# EAGLE design CFA_T_4L_B (EAGLE 9.4.2)
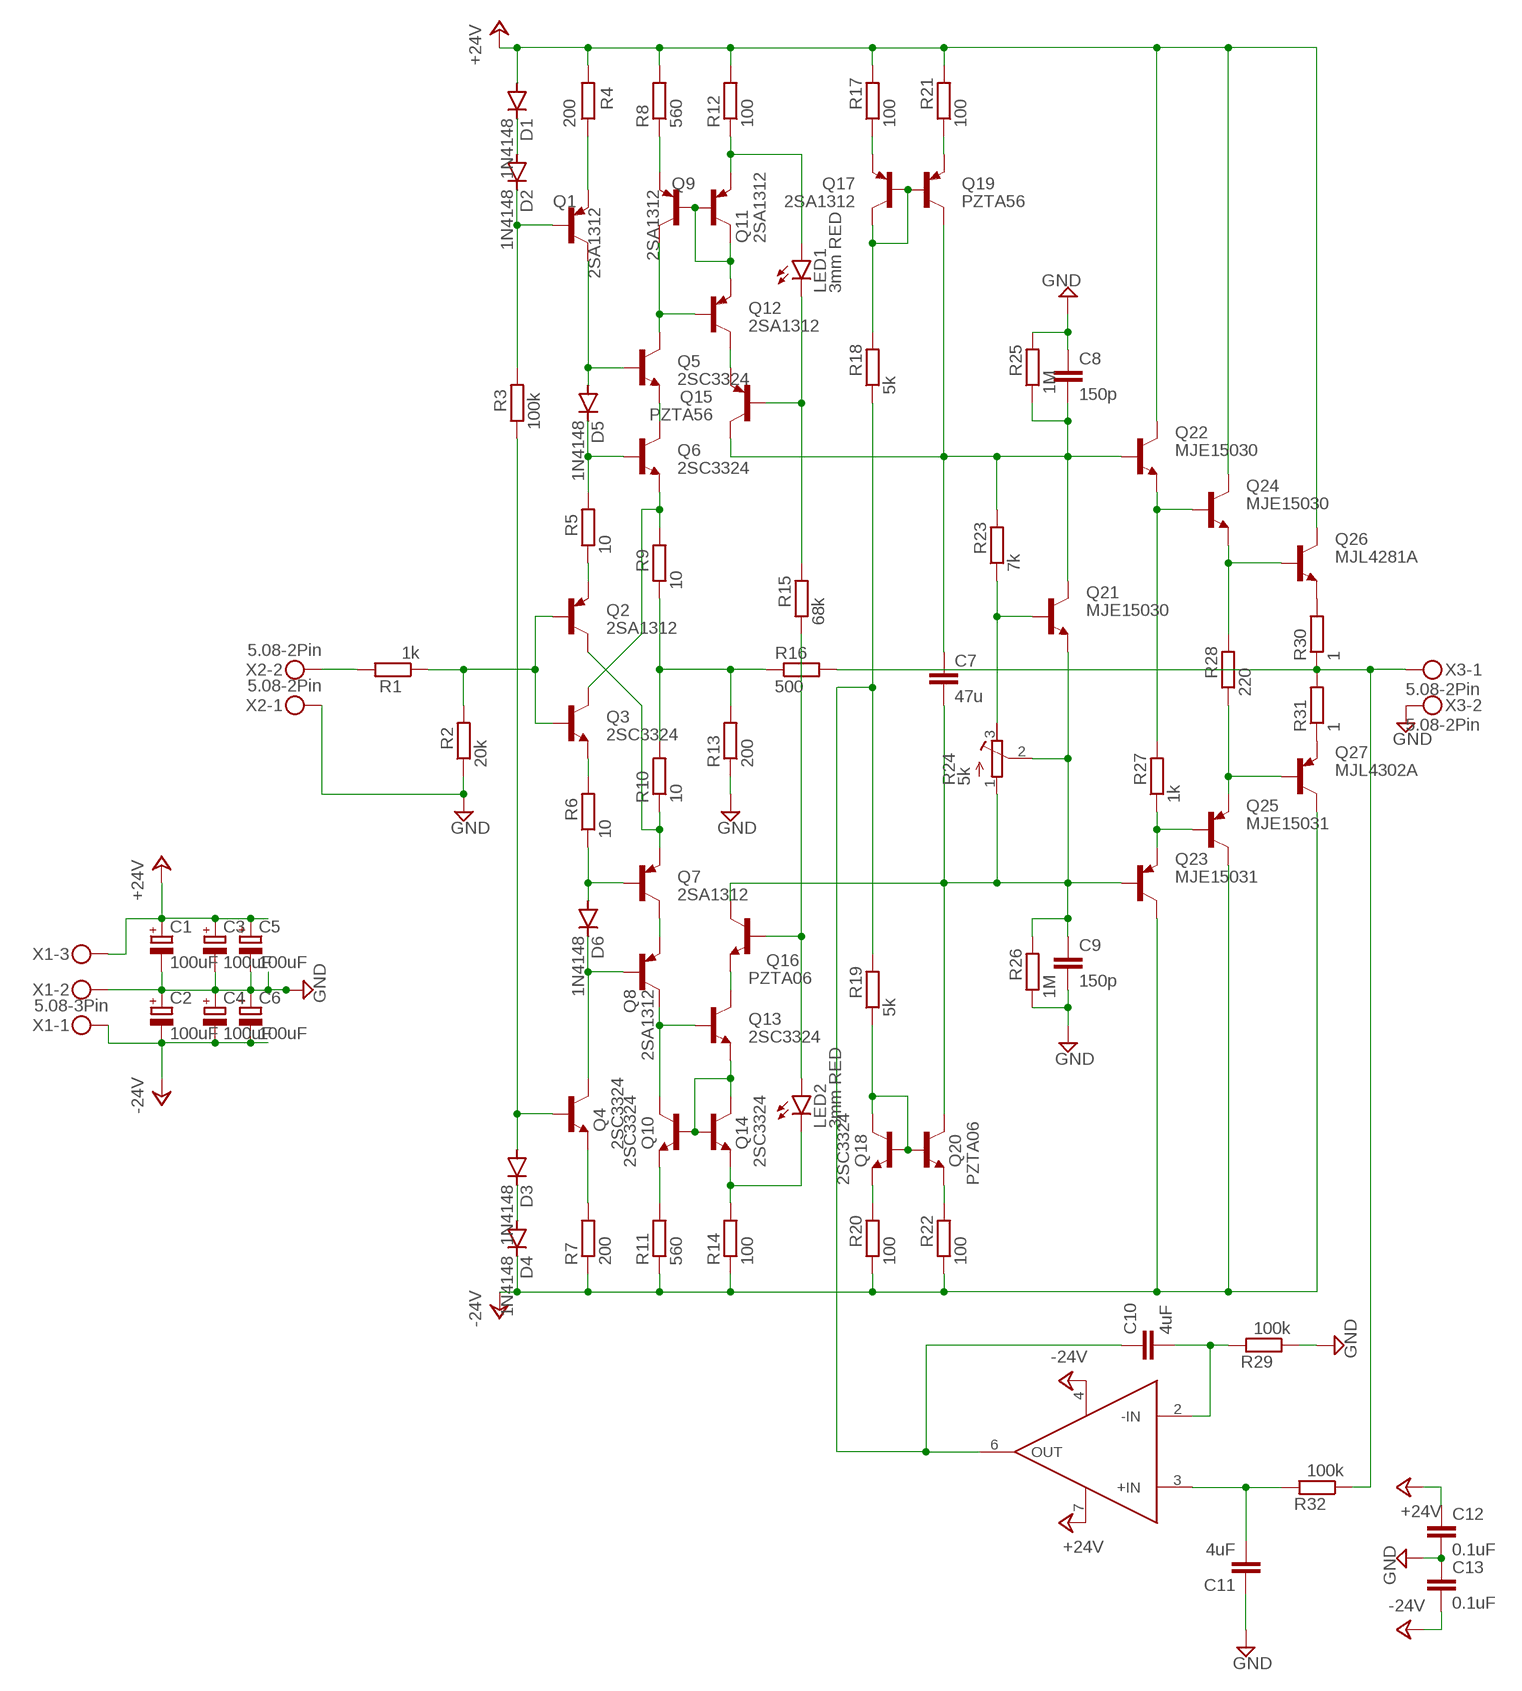
[diagram p0: schematic, sheet 1]

## Parts
C1  100uF  CPOL-EUE3.5-8  [E3,5-8]
C2  100uF  CPOL-EUE3.5-8  [E3,5-8]
C3  100uF  CPOL-EUE3.5-8  [E3,5-8]
C4  100uF  CPOL-EUE3.5-8  [E3,5-8]
C5  100uF  CPOL-EUE3.5-8  [E3,5-8]
C6  100uF  CPOL-EUE3.5-8  [E3,5-8]
C7  47u  C-EUC1210  [C1210]
C8  150p  C-EUC0805  [C0805]
C9  150p  C-EUC0805  [C0805]
C10  4uF  C-EUC1210  [C1210]
C11  4uF  C-EUC1210  [C1210]
C12  0.1uF  C-EUC0603K  [C0603K]
C13  0.1uF  C-EUC0603K  [C0603K]
D1  1N4148  DIODE-SOD80C  [SOD80C]
D2  1N4148  DIODE-SOD80C  [SOD80C]
D3  1N4148  DIODE-SOD80C  [SOD80C]
D4  1N4148  DIODE-SOD80C  [SOD80C]
D5  1N4148  DIODE-SOD80C  [SOD80C]
D6  1N4148  DIODE-SOD80C  [SOD80C]
LED1  3mm RED  LED3MM  [LED3MM]
LED2  3mm RED  LED3MM  [LED3MM]
Q1  2SA1312  TRANSISTOR_BC857C-PNP-SOT23-BEC  [TRANSISTOR_SOT23-BEC]
Q2  2SA1312  TRANSISTOR_BC857C-PNP-SOT23-BEC  [TRANSISTOR_SOT23-BEC]
Q3  2SC3324  TRANSISTOR_BC850-NPN-SOT23-BEC  [TRANSISTOR_SOT23-BEC]
Q4  2SC3324  TRANSISTOR_BC850-NPN-SOT23-BEC  [TRANSISTOR_SOT23-BEC]
Q5  2SC3324  TRANSISTOR_BC850-NPN-SOT23-BEC  [TRANSISTOR_SOT23-BEC]
Q6  2SC3324  TRANSISTOR_BC850-NPN-SOT23-BEC  [TRANSISTOR_SOT23-BEC]
Q7  2SA1312  TRANSISTOR_BC857C-PNP-SOT23-BEC  [TRANSISTOR_SOT23-BEC]
Q8  2SA1312  TRANSISTOR_BC857C-PNP-SOT23-BEC  [TRANSISTOR_SOT23-BEC]
Q9  2SA1312  TRANSISTOR_BC857C-PNP-SOT23-BEC  [TRANSISTOR_SOT23-BEC]
Q10  2SC3324  TRANSISTOR_BC850-NPN-SOT23-BEC  [TRANSISTOR_SOT23-BEC]
Q11  2SA1312  TRANSISTOR_BC857C-PNP-SOT23-BEC  [TRANSISTOR_SOT23-BEC]
Q12  2SA1312  TRANSISTOR_BC857C-PNP-SOT23-BEC  [TRANSISTOR_SOT23-BEC]
Q13  2SC3324  TRANSISTOR_BC847-NPN-SOT23-BEC  [TRANSISTOR_SOT23-BEC]
Q14  2SC3324  TRANSISTOR_BC850-NPN-SOT23-BEC  [TRANSISTOR_SOT23-BEC]
Q15  PZTA56  [SOT223]
Q16  PZTA06  PZTA06SOT-223  [SOT223]
Q17  2SA1312  TRANSISTOR_BC857C-PNP-SOT23-BEC  [TRANSISTOR_SOT23-BEC]
Q18  2SC3324  TRANSISTOR_BC850-NPN-SOT23-BEC  [TRANSISTOR_SOT23-BEC]
Q19  PZTA56  [SOT223]
Q20  PZTA06  PZTA06SOT-223  [SOT223]
Q21  MJE15030  TRANSISTOR_MJE15030  [TRANSISTOR_TO220KG]
Q22  MJE15030  TRANSISTOR_MJE15030  [TRANSISTOR_TO220KG]
Q23  MJE15031  TRANSISTOR_MJE15031  [TRANSISTOR_TO220KG]
Q24  MJE15030  TRANSISTOR_MJE15030  [TRANSISTOR_TO220KG]
Q25  MJE15031  TRANSISTOR_MJE15031  [TRANSISTOR_TO220KG]
Q26  MJL4281A  TO264_MJL4281  [TO264_TO-264]
Q27  MJL4302A  TO264_MJL4302  [TO264_TO-264]
R1  1k  R-EU_MELF0204W  [MINI_MELF-0204W]
R2  20k  R-EU_MELF0204W  [MINI_MELF-0204W]
R3  100k  R-EU_MELF0204W  [MINI_MELF-0204W]
R4  200  R-EU_MELF0204W  [MINI_MELF-0204W]
R5  10  R-EU_MELF0204W  [MINI_MELF-0204W]
R6  10  R-EU_MELF0204W  [MINI_MELF-0204W]
R7  200  R-EU_MELF0204W  [MINI_MELF-0204W]
R8  560  R-EU_MELF0204W  [MINI_MELF-0204W]
R9  10  R-EU_MELF0204W  [MINI_MELF-0204W]
R10  10  R-EU_MELF0204W  [MINI_MELF-0204W]
R11  560  R-EU_MELF0204W  [MINI_MELF-0204W]
R12  100  R-EU_MELF0204W  [MINI_MELF-0204W]
R13  200  R-EU_MELF0204W  [MINI_MELF-0204W]
R14  100  R-EU_MELF0204W  [MINI_MELF-0204W]
R15  68k  R-EU_MELF0204W  [MINI_MELF-0204W]
R16  500  R-EU_MELF0204W  [MINI_MELF-0204W]
R17  100  R-EU_MELF0204W  [MINI_MELF-0204W]
R18  5k  R-EU_MELF0204W  [MINI_MELF-0204W]
R19  5k  R-EU_MELF0204W  [MINI_MELF-0204W]
R20  100  R-EU_MELF0204W  [MINI_MELF-0204W]
R21  100  R-EU_MELF0204W  [MINI_MELF-0204W]
R22  100  R-EU_MELF0204W  [MINI_MELF-0204W]
R23  7k  R-EU_MELF0204W  [MINI_MELF-0204W]
R24  5k  R-TRIMM3296W  [RTRIM3296W]
R25  1M  R-EU_MELF0204W  [MINI_MELF-0204W]
R26  1M  R-EU_MELF0204W  [MINI_MELF-0204W]
R27  1k  R-EU_MELF0204W  [MINI_MELF-0204W]
R28  220  R-EU_MELF0204W  [MINI_MELF-0204W]
R29  100k  R-EU_MELF0204W  [MINI_MELF-0204W]
R30  1  R-EU_TO220  [TO220-2]
R31  1  R-EU_TO220  [TO220-2]
R32  100k  R-EU_MELF0204W  [MINI_MELF-0204W]
U1  OP27  OPA627BP  [DIL08]
X1  5.08-3Pin  CON-PHOENIX-508_MKDSN1,5/3-5,08  [CON-PHOENIX-508_MKDSN1,5/3-5,08]
X2  5.08-2Pin  CON-PHOENIX-508_MKDSN1,5/2-5,08  [CON-PHOENIX-508_MKDSN1,5/2-5,08]
X3  5.08-2Pin  CON-PHOENIX-508_MKDSN1,5/2-5,08  [CON-PHOENIX-508_MKDSN1,5/2-5,08]

## Nets
+24V: C1.+ C3.+ C5.+ C12.1 D1.A Q22.2(C) Q24.2(C) Q26.C R4.2 R8.2 R12.2 R17.2 R21.2 U1.7(V+) X1.3
-24V: C2.- C4.- C6.- C13.2 D4.C Q23.2(C) Q25.2(C) Q27.C R7.1 R11.1 R14.1 R20.1 R22.1 U1.4(V-) X1.1
GND: C1.- C2.+ C3.- C4.+ C5.- C6.+ C8.1 C9.2 C11.1 C12.2 C13.1 R2.1 R13.1 R25.2 R26.1 R29.1 X1.2 X2.1 X3.2
N$1: C7.2 C9.1 Q16.2(C) Q16.4(C) Q20.2(C) Q20.4(C) Q21.3(E) Q23.1(B) R24.1(A) R24.2(S) R26.2
N$2: Q21.1(B) R23.1 R24.3(E)
N$3: R1.2 X2.2
N$183: Q1.E R4.1
N$184: D5.A Q1.C Q5.B
N$185: D1.C D2.A
N$186: D2.C Q1.B R3.2
N$187: D5.C Q6.B R5.2
N$188: Q5.E Q6.C
N$189: Q3.C Q6.E R9.2
N$190: R9.1 R10.2 R13.2 R16.1
N$191: Q2.C Q7.E R10.1
N$192: D6.A Q7.B R6.1
N$193: D6.C Q4.C Q8.B
N$194: Q4.E R7.2
N$195: D3.C D4.A
N$196: Q7.C Q8.E
N$197: Q2.E R5.1
N$198: Q3.E R6.2
N$199: Q2.B Q3.B R1.1 R2.2
N$200: Q5.C Q9.C Q12.B
N$201: Q9.B Q11.B Q11.C Q12.E
N$202: Q9.E R8.1
N$203: LED1.A Q11.E R12.1
N$204: Q12.C Q15.3(E)
N$205: LED1.K(C) Q15.1(B) R15.2
N$206: Q10.B Q13.E Q14.B Q14.C
N$207: LED2.K(C) Q14.E R14.2
N$208: Q10.E R11.2
N$209: Q8.C Q10.C Q13.B
N$210: Q13.C Q16.3(E)
N$211: LED2.A Q16.1(B) R15.1
N$212: C7.1 C8.2 Q15.2(C) Q15.4(C) Q19.2(C) Q19.4(C) Q21.2(C) Q22.1(B) R23.2 R25.1
N$213: Q17.B Q17.C Q19.1(B) R18.2
N$214: Q18.B Q18.C Q20.1(B) R19.1
N$215: Q17.E R17.1
N$216: Q19.3(E) R21.1
N$218: R16.2 R30.1 R31.2 R32.1 X3.1
N$219: Q18.E R20.2
N$220: Q20.3(E) R22.2
N$221: Q22.3(E) Q24.1(B) R27.2
N$222: Q23.3(E) Q25.1(B) R27.1
N$224: Q24.3(E) Q26.B R28.2
N$225: Q25.3(E) Q27.B R28.1
N$226: Q26.E R30.2
N$227: Q27.E R31.1
N$228: C10.2 R29.2 U1.2(-IN)
N$229: C11.2 R32.2 U1.3(+IN)
N$230: D3.A Q4.B R3.1
N$232: C10.1 R18.1 R19.2 U1.6(OUT)

## Library data of the parts
C1-C6 = Vwvwbg:CPOL-EU: POLARIZED CAPACITOR, European symbol
C7-C11 = Vwvwbg:C-EU: CAPACITOR, European symbol; SPICEPREFIX: C
C12 C13 = Vwvwbg:C-EU: CAPACITOR, European symbol
D1-D6 = diode:DIODE-: DIODE; SPICEPREFIX: D
LED1 LED2 = Vwvwbg:LED: LED OSRAM: - CHIPLED LG R971, LG N971, LY N971, LG Q971, LY Q971, LO R971, LY R971 LH N974, LH R974 LS Q976, LO Q976, LY Q976 LO Q996 - Hyper CHIPLED LW Q18S LB Q993, LB Q99A, LB R99A - SideLED LS A670, LO A670, LY A670, LG A670, LP A670 LB A673, LV A673, LT A673, LW A673 LH A674 LY A675 LS A676, LA A676, LO A676, LY A676, LW A676 LS A679, LY A679, LG A679 - Hyper Micro SIDELED® LS Y876, LA Y876, LO Y876, LY Y876 LT Y87S - SmartLED LW L88C, LW L88S LB L89C, LB L89S, LG L890 LS L89K, LO L89K, LY L89K LS L896, LA L896, LO L896, LY L896 - TOPLED LS T670, LO T670, LY T670, LG T670, LP T670 LSG T670, LSP T670, LSY T670, LOP T670, LYG T670 LG T671, LOG T671, LSG T671 LB T673, LV T673, LT T673, LW T673 LH T674 LS T676, LA T676, LO T676, LY T676, LB T676, LH T676, LSB T676, LW T676 LB T67C, LV T67C, LT T67C, LS T67K, LO T67K, LY T67K, LW E67C LS E67B, LA E67B, LO E67B, LY E67B, LB E67C, LV E67C, LT E67C LW T67C LS T679, LY T679, LG T679 LS T770, LO T770, LY T770, LG T770, LP T770 LB T773, LV T773, LT T773, LW T773 LH T774 LS E675, LA E675, LY E675, LS T675 LS T776, LA T776, LO T776, LY T776, LB T776 LHGB T686 LT T68C, LB T68C - Hyper Mini TOPLED® LB M676 - Mini TOPLED Santana® LG M470 LS M47K, LO M47K, LY M47K Source: http://www.osram.convergy.de LUXEON: - LUMILED® LXK2-PW12-R00, LXK2-PW12-S00, LXK2-PW14-U00, LXK2-PW14-V00 LXK2-PM12-R00, LXK2-PM12-S00, LXK2-PM14-U00 LXK2-PE12-Q00, LXK2-PE12-R00, LXK2-PE12-S00, LXK2-PE14-T00, LXK2-PE14-U00 LXK2-PB12-K00, LXK2-PB12-L00, LXK2-PB12-M00, LXK2-PB14-N00, LXK2-PB14-P00, LXK2-PB14-Q00 LXK2-PR12-L00, LXK2-PR12-M00, LXK2-PR14-Q00, LXK2-PR14-R00 LXK2-PD12-Q00, LXK2-PD12-R00, LXK2-PD12-S00 LXK2-PH12-R00, LXK2-PH12-S00 LXK2-PL12-P00, LXK2-PL12-Q00, LXK2-PL12-R00 Source: www.luxeon.com KINGBRIGHT: KA-3528ASYC Source: www.kingbright.com; SPICEPREFIX: D
Q1 Q2 Q7-Q9 Q11 Q12 Q17 = Vwvwbg:TRANSISTOR_*-PNP-: PNP Transistror; SPICEPREFIX: Q
Q3-Q6 Q10 Q13 Q14 Q18 = Vwvwbg:TRANSISTOR_*-NPN-: NPN Transistror BF959 corrected 2008.03.06; SPICEPREFIX: Q
Q15 Q19 = Vwvwbg:PZTA56; SPICEPREFIX: Q
Q16 Q20 = Vwvwbg:PZTA06; SPICEPREFIX: Q
Q21 Q22 Q24 = Vwvwbg:TRANSISTOR_MJE15030; SPICEPREFIX: Q
Q23 Q25 = Vwvwbg:TRANSISTOR_MJE15031; SPICEPREFIX: Q
Q26 = Vwvwbg:TO264_MJL4281: MJL4281 NPN BCE TO-264; SPICEPREFIX: Q
Q27 = Vwvwbg:TO264_MJL4302: MJL4302 PNP BCE TO-264; SPICEPREFIX: Q
R1-R23 R25-R32 = Vwvwbg:R-EU_: RESISTOR, European symbol; SPICEPREFIX: R
R24 = rcl_mod:R-TRIMM: Trimm resistor; SPICEMODEL: X; SPICEPREFIX: Z; SPICEPREFIXL: POT
U1 = Vwvwbg:OPA627BP: OPERATIONAL AMPLIFIER
X1 = Vwvwbg:CON-PHOENIX-508_MKDSN1,5/3-5,08: MKDSN 1,5/ 3-5,08 Printklemme Nennstrom: 13,5 A Nennspannung: 250 V Rastermaß: 5,08 mm Polzahl: 3 Anschlussart: Schraubanschluss Montage: Löten Anschlussrichtung Leiter/Platine: 0 ° Artikelnummer: 1729131 Source: http://eshop.phoenixcontact.com .. 1729131.pdf
X2 X3 = Vwvwbg:CON-PHOENIX-508_MKDSN1,5/2-5,08: MKDSN 1,5/ 2-5,08 Printklemme Nennstrom: 13,5 A Nennspannung: 250 V Rastermaß: 5,08 mm Polzahl: 2 Anschlussart: Schraubanschluss Montage: Löten Anschlussrichtung Leiter/Platine: 0 ° Artikelnummer: 1729128 Source: http://eshop.phoenixcontact.com .. 1729128.pdf

## Board
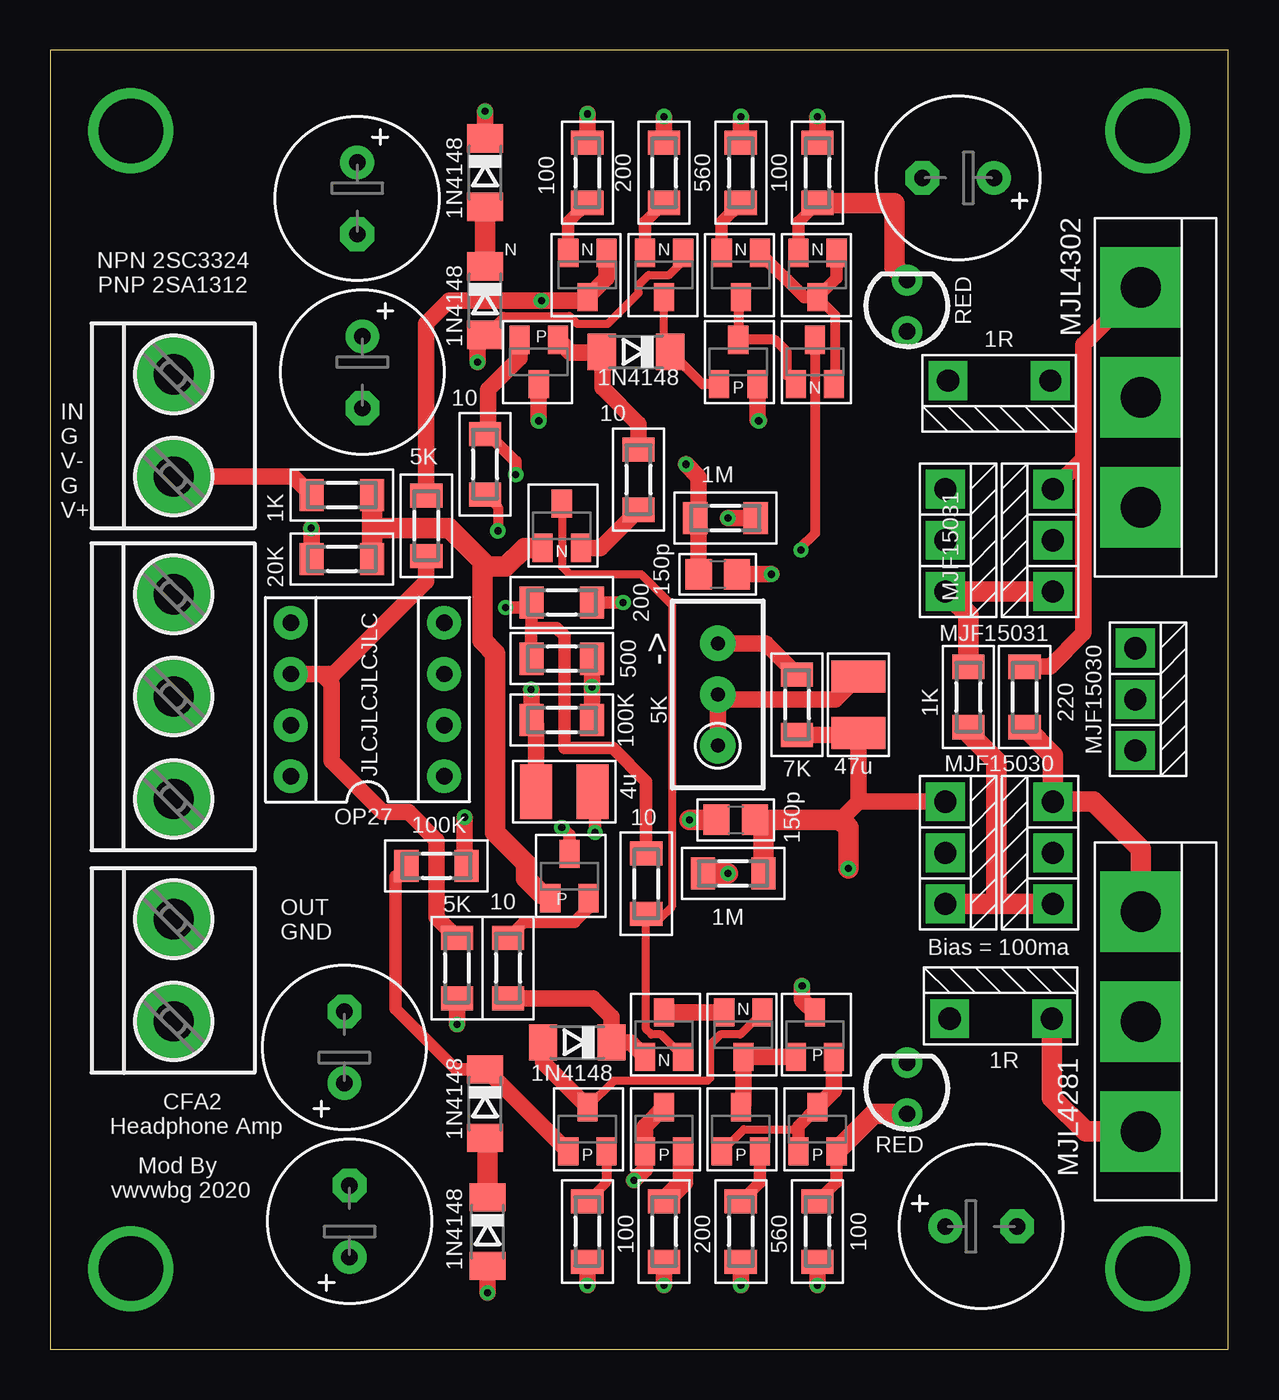
[diagram p1: board, top side]
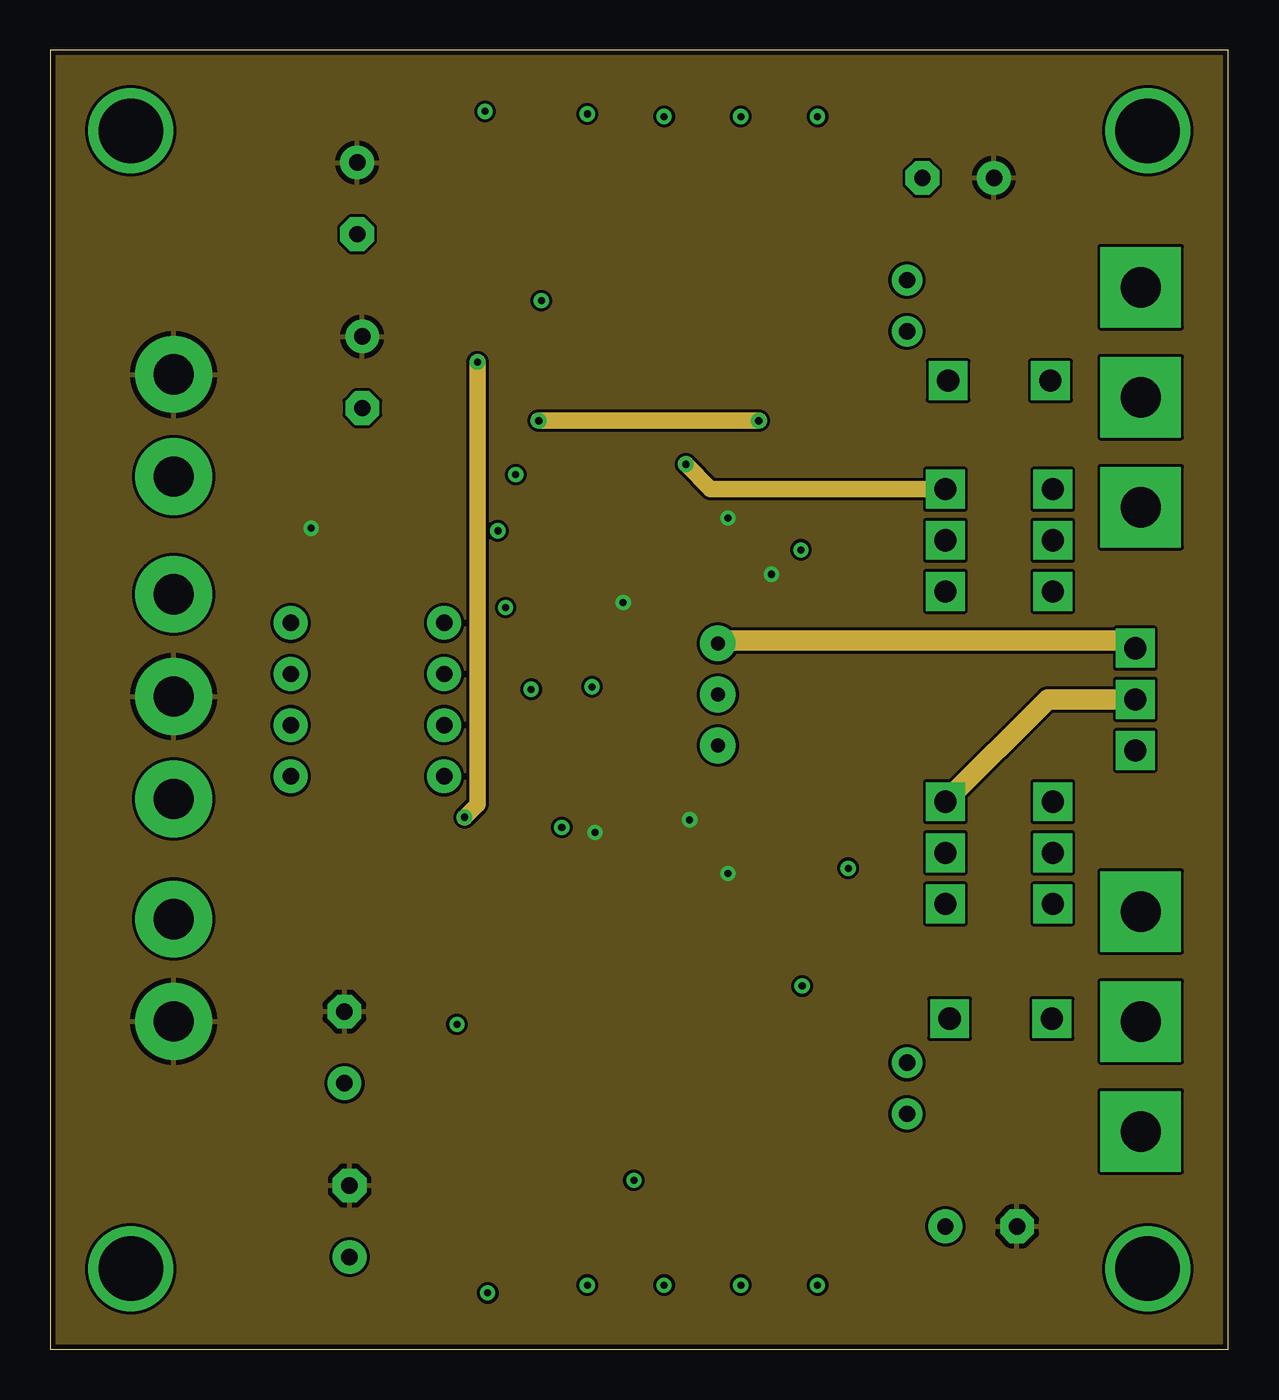
[diagram p2: board, inner layer Route2]
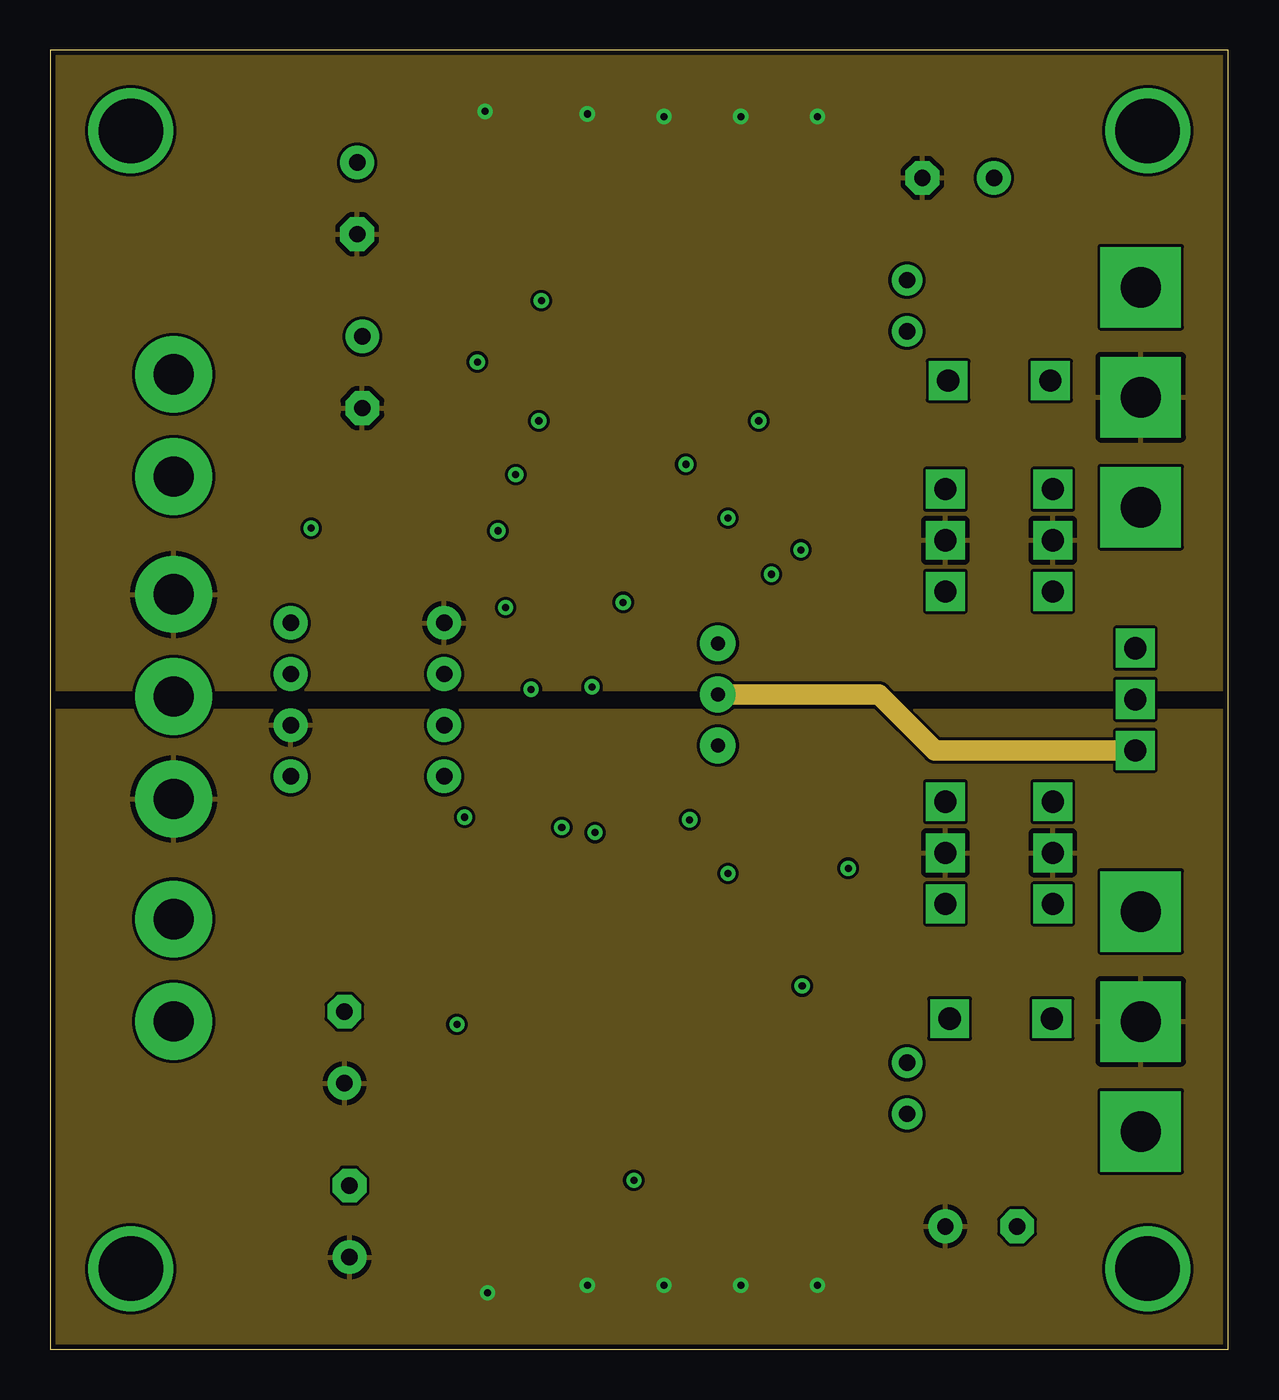
[diagram p3: board, inner layer Route15]
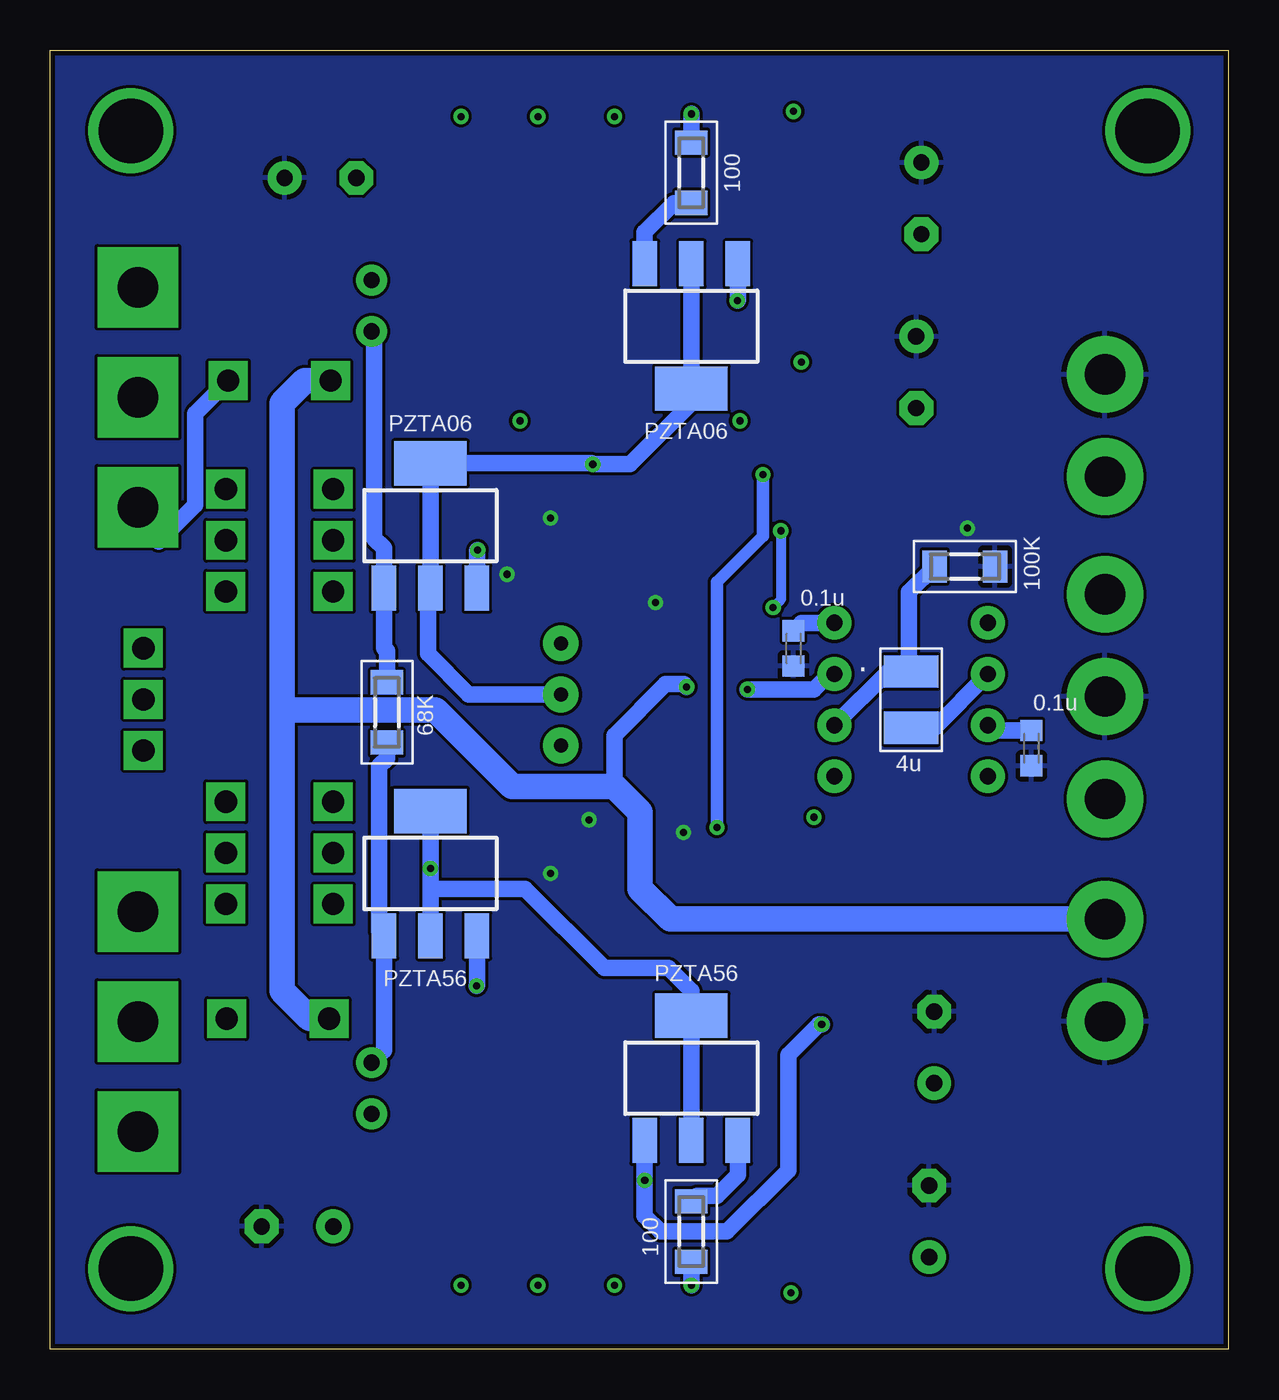
[diagram p4: board, bottom side, seen from below]

Size 58.5 x 64.5 mm. Coordinates in mm from the lower left corner, seen from the top.
Outline: 0,0 58.5,0 58.5,64.5 0,64.5 0,0
Copper layers (1+2*15+16): Top 0.035mm / dielectric 1.5mm / Route2 0.035mm / dielectric 0.15mm / Route15 0.035mm / dielectric 0.2mm / Bottom 0.035mm
Design rules "default *": minimum track width 6mil, minimum drill 0.35mm, track to track 6mil, track to pad 6mil, pad to pad 6mil, via to via 6mil, smd to smd 6mil, copper to edge 10mil, drill to drill 6mil, minimum pad ring 10mil, minimum via ring 8mil, stop-mask expansion 4mil, vias tented up to drill 0.35mm, thermal gap 10mil

### Footprints (pad centres in the part's own frame; a part is rotated, then mirrored left to right if it is on the bottom)
E3,5-8 = drill 0.813 pad 1.676: + -1.778,0 | drill 0.813 pad 1.676 octagon: - 1.778,0
C1210 = smd 1.6 x 2.7: 1 -1.4,0; 2 1.4,0
C0805 = smd 1.3 x 1.5: 1 -0.95,0; 2 0.95,0
C0603K = smd 1.05 x 1.08: 1 -0.875,0; 2 0.875,0
SOD80C = smd 1.4 x 1.8: A 1.7,0; C -1.7,0
LED3MM = drill 0.813 pad 1.524: A -1.27,0; K 1.27,0
TRANSISTOR_SOT23-BEC = smd 1 x 1.4: B -0.95,-1.1; C 0,1.1; E 0.95,-1.1
SOT223 = smd 1.219 x 2.235: 1 -2.311,-3.099; 2 0,-3.099; 3 2.311,-3.099 | smd 3.6 x 2.2: 4 0,3.099
TRANSISTOR_TO220KG = drill 1.1 pad 1.93 square: 1 -2.54,0; 2 0,0; 3 2.54,0
TO264_TO-264 = drill 2 pad 4 square: B -5.461,0; C 0,0; E 5.461,0
MINI_MELF-0204W = smd 1.2 x 1.6: 1 -1.5,0; 2 1.5,0
RTRIM3296W = drill 0.7 pad 1.778: 1 0,-2.54; 2 0,0; 3 0,2.54
TO220-2 = drill 1.1 pad 1.93 square: 1 -2.54,0; 2 2.54,0
DIL08 = drill 0.813 pad 1.676: 1 -3.81,-3.81; 2 -1.27,-3.81; 3 1.27,-3.81; 4 3.81,-3.81; 5 3.81,3.81; 6 1.27,3.81; 7 -1.27,3.81; 8 -3.81,3.81
CON-PHOENIX-508_MKDSN1,5/3-5,08 = drill 2 pad 3.81: 1 -7.641,0.025; 2 -2.561,0.025; 3 2.519,0.025
CON-PHOENIX-508_MKDSN1,5/2-5,08 = drill 2 pad 3.81: 1 -2.561,0.025; 2 2.519,0.025

### Placement (x,y rotation side)
C1  14.61,14.99 90 top
C2  15.49,48.51 270 top
C3  14.86,6.35 90 top
C4  15.24,57.15 270 top
C5  46.23,6.1 0 top
C6  45.09,58.17 180 top
C7  40.13,32 90 top
C8  34.04,26.29 0 top
C9  33.15,38.48 0 top
C10  15.75,32.26 90 bottom
C11  25.53,27.69 180 top
C12  9.78,29.84 270 bottom
C13  21.59,34.8 90 bottom
D1  21.72,5.84 270 top
D2  21.59,12.19 270 top
D3  21.59,52.07 270 top
D4  21.59,58.42 270 top
D5  26.16,15.24 180 top
D6  29.08,49.53 180 top
LED1  42.55,12.95 90 top
LED2  42.55,51.82 90 top
Q1  26.67,10.92 0 top
Q2  25.78,23.5 0 top
Q3  25.4,40.89 0 top
Q4  30.48,53.34 180 top
Q5  34.42,15.62 180 top
Q6  30.48,15.62 0 top
Q7  24.26,49.02 180 top
Q8  34.16,49.02 0 top
Q9  34.29,10.92 0 top
Q10  34.29,53.34 180 top
Q11  38.1,10.92 0 top
Q12  37.97,15.62 0 top
Q13  37.97,49.02 0 top
Q14  38.1,53.34 180 top
Q15  39.62,23.62 0 bottom
Q16  39.62,40.89 0 bottom
Q17  30.48,10.92 0 top
Q18  26.67,53.34 180 top
Q19  26.67,13.46 0 bottom
Q20  26.67,50.8 180 bottom
Q21  53.88,32.27 270 top
Q22  44.45,24.65 270 top
Q23  44.45,40.17 270 top
Q24  49.78,24.65 90 top
Q25  49.78,40.17 90 top
Q26  54.15,16.27 270 top
Q27  54.15,47.27 270 top
R1  14.48,42.42 180 top
R2  14.48,39.24 0 top
R3  19.18,24 180 top
R4  26.67,5.84 270 top
R5  22.73,18.92 270 top
R6  29.21,43.18 270 top
R7  30.48,58.42 270 top
R8  34.29,5.84 270 top
R9  29.59,23.11 270 top
R10  21.59,43.94 270 top
R11  34.29,58.42 270 top
R12  38.1,5.84 270 top
R13  25.4,37.08 180 top
R14  38.1,58.42 270 top
R15  41.78,31.62 270 bottom
R16  25.4,34.29 0 top
R17  30.48,5.84 270 top
R18  20.19,18.92 270 top
R19  18.67,40.89 270 top
R20  26.67,58.42 270 top
R21  26.67,5.84 270 bottom
R22  26.67,58.42 270 bottom
R23  37.08,32 270 top
R24  33.15,32.51 0 top
R25  33.91,23.62 180 top
R26  33.53,41.27 180 top
R27  45.59,32.38 270 top
R28  48.39,32.38 270 top
R29  13.08,38.86 180 bottom
R30  47.2,16.41 0 top
R31  47.13,48.1 180 top
R32  25.4,31.24 180 top
U1  15.75,32.26 90 top
X1  6.1,29.84 270 top
X2  6.1,45.85 270 top
X3  6.1,18.8 270 top

### Tracks (layer width: path | path; a pad name or v marks a point on that pad's centre or on a via)
+24V  (via drill 0.35)
  Top 0.813: D1.A v21.72,2.79 | v30.48,3.17 R17.2 | R8.2 v34.29,3.17 | R12.2 v38.1,3.17 | R21.2 v26.67,3.17
  Bottom 0.813: R21.2 v26.67,3.17 | C12.1 11.67,30.72 U1.7
  pour Route15: -17.78,31.75 66.04,31.75 66.04,-2.54 -17.78,-2.54
-24V  (via drill 0.35)
  Top 0.813: D4.C v21.59,61.47 | R22.1 v26.67,61.34 | R7.1 v30.48,61.21 | R11.1 v34.29,61.21 | R14.1 v38.1,61.21
  Bottom 0.813: R22.1 v26.67,61.34 | U1.4 21.2,36.07 C13.2
  pour Route15: -21.59,32.77 66.04,32.77 66.04,68.58 -21.59,68.58
GND  (via drill 0.35)
  Top 0.508: C11.1 27.03,27.59
  Top 0.61: 27.03,27.59 27.05,27.56 v27.05,25.65 | R13.1 v28.45,37.08
  Top 0.813: C9.2 v35.81,38.48 | R26.1 v33.66,41.27 | R2.1 12.98,40.74 v12.95,40.77
  Top 1.016: C8.1 v31.75,26.29 | R25.2 v33.66,23.62
  pour Bottom: -8.89,67.31 67.31,67.31 67.31,-2.54 -8.89,-2.54
  pour Route2: -19.05,68.58 60.96,68.58 60.96,-2.54 -19.05,-2.54
N$1  (via drill 0.35)
  Top 0.813: 32.2,41.44 32.2,43.31 v31.56,43.94 | 32.2,41.44 R26.2 | 32.2,41.44 C9.1 | R24.1 R24.2 33.4,32.26 38.99,32.26 C7.2
  Route2 0.813: Q23.1 32.8,42.71 v31.56,43.94
  Route15 1.016: Q21.3 43.93,29.73 41.15,32.51 R24.2
  Bottom 0.813: Q20.2 Q20.4 26.67,46.99 29.72,43.94 v31.56,43.94 31.61,43.99 Q16.4 Q16.2 39.75,37.67 39.75,34.54 37.72,32.51 R24.2
N$2
  Top 0.813: R23.1 35.54,35.05 R24.3
  Route2 0.813: 33.27,35.18 R24.3
  Route2 1.016: Q21.1 53.51,35.18 33.27,35.18
N$3
  Top 0.813: R1.2 12.07,43.33 X2.2
N$4  (via drill 3.2)
  other vias: 4,4
N$5  (via drill 3.2 pad 0.8)
  other vias: 54.5,4
N$6  (via drill 3.2 pad 0.8)
  other vias: 4,60.5
N$7  (via drill 3.2 pad 0.8)
  other vias: 54.5,60.5
N$183
  Top 0.508: Q1.E 27.62,8.29 R4.1
N$184
  Top 0.406: Q5.B 34.27,15.62 33.27,15.62 32.77,15.11 32.77,13.46 32.64,13.34 27.98,13.34 Q1.C
  Top 0.813: Q1.C 24.46,14.23 D5.A
N$185
  Top 1.016: D1.C 21.72,10.37 D2.A
N$186
  Top 0.61: D2.C 20.14,13.89 17.14,16.89 17.14,23.47 R3.2
  Top 0.813: Q1.B 21.65,13.89 D2.C
N$187
  Top 0.813: Q6.B 28.81,15.24 D5.C 27.86,16.51 26.95,17.42 R5.2
N$188
  Top 0.406: 33.35,16.84 Q5.E
  Top 0.813: Q6.C 33.23,16.72 33.35,16.84
N$189
  Top 0.406: Q6.E 30.33,15.62 29.84,15.62 29.59,15.88 R9.2 29.87,21.34 30.23,21.34 30.86,21.97 30.86,36.96 29.34,38.48 25.78,38.48 25.4,38.86 Q3.C
N$190  (via drill 0.35)
  Top 0.508: R10.2 22.23,41.81 v22.23,40.64
  Top 0.61: 23.88,35.81 23.88,34.31 R16.1 | 23.88,35.81 23.9,35.84 R13.2 23.65,36.83 v22.61,36.83 | 23.88,35.81 25.15,35.81 25.53,35.43 25.53,29.84 27.94,29.84 29.59,28.19 R9.1
  Bottom 0.508: v22.61,36.83 22.23,37.21 v22.23,40.64
N$191  (via drill 0.35)
  Top 0.61: v23.11,43.43 23.11,44.07 21.74,45.44 R10.1 | v25.4,25.91 25.78,25.53 Q2.C
  Top 0.813: Q7.E 23.31,49.22 21.74,47.65 21.74,45.44
  Bottom 0.61: v23.11,43.43 23.11,40.39 25.4,38.1 v25.4,25.91
N$192
  Top 0.813: R6.1 29.21,45.95 27.42,47.74 27.42,49.49 | 27.42,49.49 D6.A | Q7.B 25.84,49.49 27.42,49.49
N$193
  Top 0.406: D6.C 30.48,49.83 Q4.C
  Top 0.508: Q8.B 32.39,47.92 D6.C
N$194
  Top 0.61: R7.2 29.53,55.97 Q4.E
N$195
  Top 1.016: D4.A D3.C
N$196  (via drill 0.35)
  Top 0.813: Q7.C v24.26,46.1 | v35.18,46.1 35.11,46.17 Q8.E
  Route2 0.813: v24.26,46.1 v35.18,46.1
N$197
  Top 0.61: R5.1 23.52,21.21 26.04,21.21 26.73,21.91 Q2.E
N$198
  Top 0.813: Q3.E 27.32,39.79 R6.2
N$199
  Top 0.508: Q2.B 24.59,22.39
  Top 0.813: 24.59,22.39 24.38,22.61
  Top 1.016: R1.1 15.98,40.77 | 15.98,40.77 R2.2 | 24.38,22.61 23.62,23.37 23.62,24.13 22.1,25.65 22.1,34.54 21.46,35.18 21.46,38.86 21.72,38.86 | 15.98,40.77 19.81,40.77 21.72,38.86 | Q3.B 23.54,39.79 22.61,38.86 21.72,38.86
N$200
  Top 0.813: Q9.C 34.42,12.15 Q5.C Q12.B
N$201
  Top 0.406: Q9.B 34.44,10.92 37,10.92 37.15,11.07
  Top 0.61: Q11.C 37.15,11.07 Q11.B
  Top 0.813: Q12.E 38.92,12.85 Q11.C
N$202
  Top 0.61: R8.1 35.24,8.29 Q9.E
N$203
  Top 0.61: R12.1 39.05,8.29 Q11.E
  Top 1.016: Q11.E 40.91,11.68 LED1.A
N$204  (via drill 0.35)
  Top 0.813: Q12.C 37.34,17.36 v37.34,18.03
  Bottom 0.813: v37.34,18.03 37.31,18.06 Q15.3
N$205
  Bottom 0.813: R15.2 41.78,29.34 42.16,28.96 42.16,20.75 Q15.1 41.94,14.83 LED1.K
N$206
  Top 0.508: Q13.E 38.99,47.99 38.99,51.35 Q14.C
  Top 0.61: Q14.B 39.05,53.19 Q14.C 37.44,52.24 Q10.B
N$207
  Top 0.61: R14.2 37.15,55.97 Q14.E
  Top 1.016: LED2.K 41.91,53.72 41.91,56.92 R14.2
N$208
  Top 0.61: R11.2 33.34,55.97 Q10.E
N$209
  Top 0.508: Q10.C 34.16,52.11 Q8.C 35.98,50.12 36.58,49.53 36.58,48.37 Q13.B
N$210  (via drill 0.35)
  Top 0.508: Q13.C 37.97,40.51 37.21,39.75 v37.27,39.69
  Bottom 0.813: Q16.3 37.31,39.65 v37.27,39.69
N$211
  Bottom 0.813: R15.1 41.78,34.67 41.94,34.82 Q16.1 41.94,39.78 42.42,40.26 42.42,50.42 LED2.A
N$212  (via drill 0.35)
  Top 0.813: 40.03,30.5 R23.2 | 35.43,26.29 C8.2 | C7.1 40.13,27.18 | 40.13,27.18 39.24,26.29 | Q22.1 40.14,27.19 40.13,27.18
  Top 1.016: C7.1 40.03,30.5 | R25.1 35.41,26.27 35.43,26.29 | C8.2 39.24,26.29 39.62,25.91 v39.62,23.88
  Route2 1.016: Q21.2 49.53,32.27 Q22.1
  Bottom 0.813: Q15.4 v39.62,23.88 39.62,22.86 | 39.62,22.86 Q15.2 | Q19.2 Q19.4 26.67,17.78 27.81,18.92 30.99,18.92 34.92,22.86 39.62,22.86
N$213  (via drill 0.35)
  Top 0.813: Q17.C 29.53,11.07 Q17.B 29.53,8.93 v28.98,8.38 | R18.2 v20.19,16.13
  Bottom 0.813: Q19.1 v28.98,8.38 28.98,6.63 28.19,5.84 24.89,5.84 21.84,8.89 21.84,14.61 20.32,16.13 v20.19,16.13
N$214  (via drill 0.35)
  Top 0.813: Q18.B 27.62,53.19 Q18.C 26.5,52.07 v24.38,52.07 19.81,52.07 18.67,50.93 R19.1
  Bottom 0.813: Q20.1 24.36,52.09 v24.38,52.07
N$215
  Top 1.016: Q17.E 31.43,8.29 R17.1
N$216
  Bottom 0.813: R21.1 26.39,7.62 25.4,7.62 24.36,8.66 Q19.3
N$218  (via drill 0.35)
  Top 0.813: R16.2 v26.9,32.89 R32.1
  Bottom 0.813: 30.48,27.94 30.48,30.48 27.94,33.02 27.03,33.02 v26.9,32.89
  Bottom 1.27: X3.1 27.71,21.36 29.21,22.86 29.21,26.67 30.48,27.94 35.56,27.94 39.37,31.75 40.64,31.75 40.66,31.74 42.91,31.74 42.92,31.75 46.99,31.75 | 46.99,31.75 46.99,17.78 45.62,16.41 R30.1 | 46.99,31.75 46.99,46.99 45.88,48.1 R31.2
N$219
  Top 0.61: R20.2 25.72,55.97 Q18.E
N$220
  Bottom 0.813: Q20.3 28.98,55.47 27.54,56.92 R22.2
N$221
  Top 1.016: R27.2 45.72,30.76 45.72,30.48 46.99,29.21 46.99,22.11 | Q22.3 46.99,22.11 | 46.99,22.11 Q24.1
N$222
  Top 1.016: Q25.1 Q23.3 45.59,36.49 R27.1
N$224
  Top 1.016: R28.2 49.78,29.49 Q24.3 51.8,27.19 54.15,24.84 Q26.B
N$225
  Top 0.813: 51.31,44.23 Q25.3 | R28.1 48.41,33.91 49.66,33.91 51.31,35.56 51.31,44.23 | Q27.B 51.31,49.89 51.31,44.23
N$226
  Top 1.016: Q26.E 51.42,10.81 49.74,12.49 R30.2
N$227
  Bottom 0.813: R31.1 51.31,46.46 51.31,41.91 53.11,40.11 Q27.E
N$228
  Bottom 0.813: U1.2 16.89,33.66 C10.2 15.85,33.76 15.85,37.59 R29.2
N$229  (via drill 0.35)
  Top 0.813: C11.2 24.13,31.02 R32.2 23.9,32.74 v23.88,32.77
  Bottom 0.813: U1.3 19.81,33.53 20.57,32.77 v23.88,32.77
N$230  (via drill 0.35)
  Top 0.406: D3.A 22.53,51.31 25.78,51.31 26.16,50.93 27.69,50.93 29.21,52.45 29.21,52.83 29.72,53.34 30.73,53.34 31.43,54.04 Q4.B
  Top 0.508: D3.A 21.59,50.29
  Top 0.61: R3.1 20.57,24.11
  Top 0.813: 21.59,50.29 21.21,49.91 v21.21,49.02 | 20.57,24.11 v20.57,26.42
  Route2 0.813: v21.21,49.02 21.21,27.05 v20.57,26.42
N$232
  Top 0.813: R18.1 19.18,21.44 19.18,25.27 17.78,26.67 16.51,26.67 13.97,29.21 13.97,33.02 13.46,33.53 U1.6 14.07,33.53 18.67,38.12 R19.2
  Bottom 0.813: U1.6 14.61,30.86 C10.1

### Text on the board
tPlace: 1N4148 | 100 | 200 | 560 | 100 | N | N | N | N | N | NPN 2SC3324 / PNP 2SA1312 | 1N4148 | RED | P | 1R | MJL4302 | 1N4148 | P | N | 10 | 10 | 5K | 1M | 1K | IN / G / V- / G / V+ | N | MJF15031 | 20K | 150p | 200 | MJF15031 | -> | 500 | 5K | 1K | 220 | MJF15030 | 100K | 7K | 47u | MJF15030 | JLCJLCJLCJLC | 4u | OP27 | 100K | 10 | 150p | 5K | 10 | P | 1M | OUT / GND | Bias = 100ma | N | P | 1N4148 | N | 1R | MJL4281 | CFA2 / Headphone Amp | 1N4148 | P | P | P | P | RED | Mod By / vwvwbg 2020 | 1N4148 | 100 | 200 | 560 | 100
bPlace: 100 | PZTA06 | PZTA06 | 100K | 0.1u | . | 0.1u | 68K | 4u | PZTA56 | PZTA56 | 100